# EAGLE design cellular shield-v12 (EAGLE 5.11)
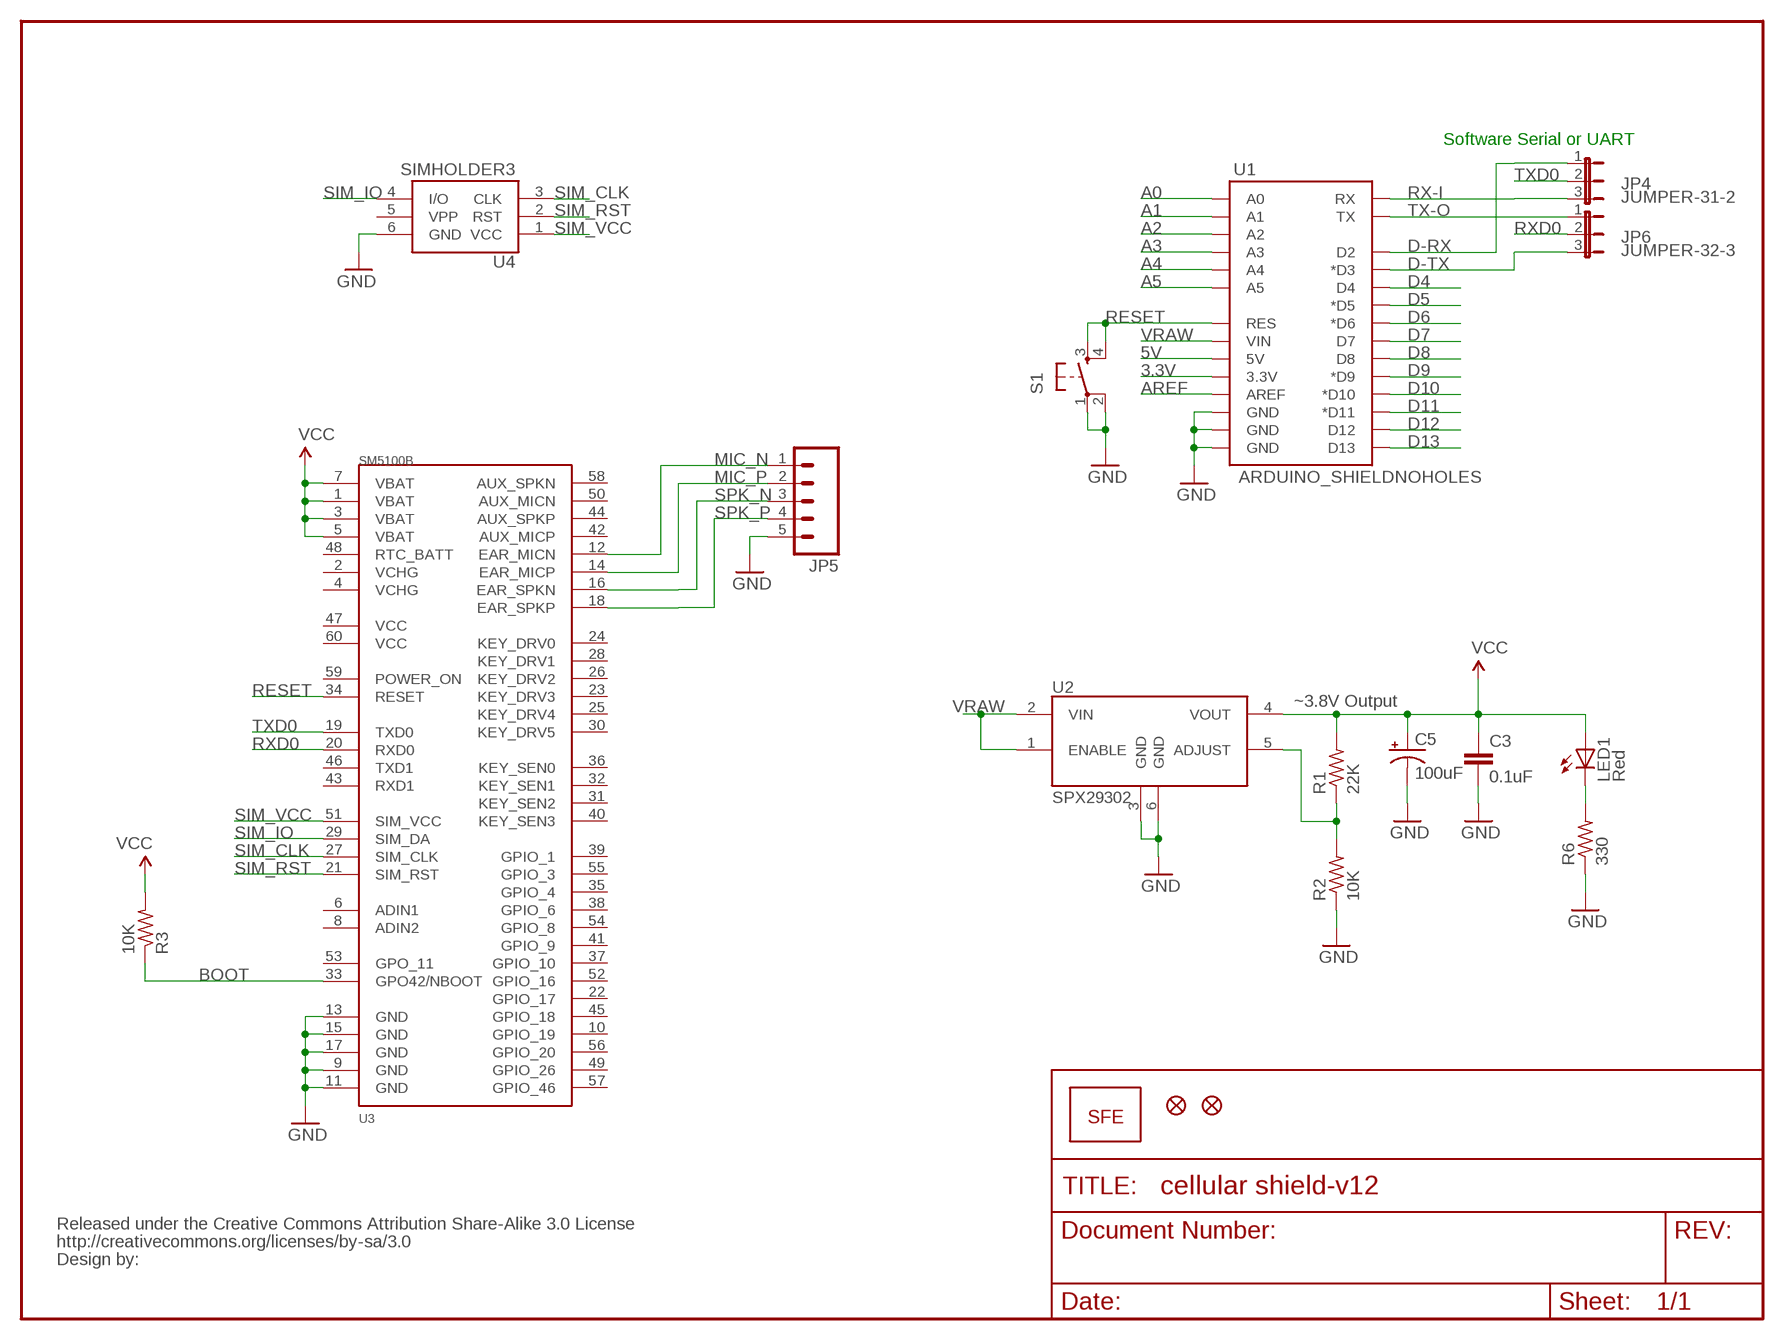
[diagram p0: schematic, sheet 1]

## Parts
C3  0.1uF  CAP0603-CAP  [0603-CAP]
C5  100uF  CAP_POL7343  [EIA7343]
JP1  LOGO-SFENEW  [SFE-NEW-WEBLOGO]
JP2  FIDUCIAL1X2  [FIDUCIAL-1X2]
JP3  FIDUCIAL1X2  [FIDUCIAL-1X2]
JP4  JUMPER-31-2  [SJ_3_PASTE1&2]
JP5  M05PTH  [1X05]
JP6  JUMPER-32-3  [SJ_3_PASTE2&3]
LED1  Red  LED0603  [LED-0603]
R1  22K  R-US_R0603  [R0603]
R2  10K  R-US_R0603  [R0603]
R3  10K  R-US_R0603  [R0603]
R6  330  R-US_R0603  [R0603]
S1  TAC_SWITCHSMD  [TACTILE_SWITCH_SMD]
U1  ARDUINO_SHIELDNOHOLES  [DUEMILANOVE_SHIELD_NOHOLES]
U2  SPX29302  [Q5-DD_SPX29300]
U3  SM5100B  [SM5100B]
U4  SIMHOLDER3  [SIMHOLDER3]
U$1  CREATIVE_COMMONS  [CREATIVE_COMMONS]

## Nets
3.3V: U1.3.3V
5V: U1.5V
A0: U1.A0
A1: U1.A1
A2: U1.A2
A3: U1.A3
A4: U1.A4
A5: U1.A5
ADJUST: R1.1 R2.2 U2.5(ADJUST)
AREF: U1.AREF
BOOT: R3.1 U3.33(GPO42/NBOOT)
D4: U1.D4
D5: U1.D5(*D5)
D6: U1.D6(*D6)
D7: U1.D7
D8: U1.D8
D9: U1.D9(*D9)
D10: U1.D10(*D10)
D11: U1.D11(*D11)
D12: U1.D12
D13: U1.D13
D-RX: JP4.1 U1.D2
D-TX: JP6.3 U1.D3(*D3)
GND: C3.2 C5.C(-) JP5.5 R2.1 R6.1 S1.1 S1.2 U1.GND@0(GND) U1.GND@1(GND) U1.GND@2(GND) U2.3(GND) U2.6(GND) U3.9(GND) U3.11(GND) U3.13(GND) U3.15(GND) U3.17(GND) U4.6(GND)
MIC_N: JP5.1 U3.12(EAR_MICN)
MIC_P: JP5.2 U3.14(EAR_MICP)
N$17: LED1.C R6.2
RESET: S1.3 S1.4 U1.RES U3.34(RESET)
RX-I: JP4.3 U1.RX
RXD0: JP6.2 U3.20(RXD0)
SIM_CLK: U3.27(SIM_CLK) U4.3(CLK)
SIM_IO: U3.29(SIM_DA) U4.4(I/O)
SIM_RST: U3.21(SIM_RST) U4.2(RST)
SIM_VCC: U3.51(SIM_VCC) U4.1(VCC)
SPK_N: JP5.3 U3.16(EAR_SPKN)
SPK_P: JP5.4 U3.18(EAR_SPKP)
TX-O: JP6.1 U1.TX
TXD0: JP4.2 U3.19(TXD0)
VCC: C3.1 C5.A(+) LED1.A R1.2 R3.2 U2.4(VOUT) U3.1(VBAT) U3.3(VBAT) U3.5(VBAT) U3.7(VBAT)
VRAW: U1.VIN U2.1(ENABLE) U2.2(VIN)
Unconnected: U3.2(VCHG) U3.4(VCHG) U3.6(ADIN1) U3.8(ADIN2) U3.10(GPIO_19) U3.22(GPIO_17) U3.23(KEY_DRV3) U3.24(KEY_DRV0) U3.25(KEY_DRV4) U3.26(KEY_DRV2) U3.28(KEY_DRV1) U3.30(KEY_DRV5) U3.31(KEY_SEN2) U3.32(KEY_SEN1) U3.35(GPIO_4) U3.36(KEY_SEN0) U3.37(GPIO_10) U3.38(GPIO_6) U3.39(GPIO_1) U3.40(KEY_SEN3) U3.41(GPIO_9) U3.42(AUX_MICP) U3.43(RXD1) U3.44(AUX_SPKP) U3.45(GPIO_18) U3.46(TXD1) U3.47(VCC) U3.48(RTC_BATT) U3.49(GPIO_26) U3.50(AUX_MICN) U3.52(GPIO_16) U3.53(GPO_11) U3.54(GPIO_8) U3.55(GPIO_3) U3.56(GPIO_20) U3.57(GPIO_46) U3.58(AUX_SPKN) U3.59(POWER_ON) U3.60(VCC) U4.5(VPP)

## Notes on the sheet
- Software Serial or UART
- ~3.8V Output

## Library data of the parts
C3 = SparkFun:CAP: Capacitor Standard 0603 ceramic capacitor, and 0.1" leaded capacitor.
C5 = SparkFun:CAP_POL: Capacitor Polarized These are standard SMD and PTH capacitors. Normally 10uF, 47uF, and 100uF in electrolytic and tantalum varieties. Always verify the external diameter of the through hole cap, it varies with capacity, voltage, and manufacturer. The EIA devices should be standard.
JP1 = SparkFun:LOGO-SFE: Spark Fun Electronics PCB Logo This is the standard Spark Fun Electronics PCB logo.
JP2 JP3 = SparkFun:FIDUCIAL: Fiducial Alignment Points Various fiducial points for machine vision alignment.
JP4 JP6 = SparkFun:JUMPER-3
JP5 = SparkFun:M05: Header 5 Standard 5-pin 0.1" header. Use with straight break away headers (SKU : PRT-00116), right angle break away headers (PRT-00553), swiss pins (PRT-00743), machine pins (PRT-00117), and female headers (PRT-00115). Molex polarized connector foot print use with SKU : PRT-08230 with associated crimp pins and housings.
LED1 = SparkFun:LED: LEDs Standard schematic elements and footprints for 5mm, 3mm, 1206, and 0603 sized LEDs. 5mm - Spark Fun Electronics SKU : COM-00529 (and others)
R1-R3 R6 = rcl:R-US_: RESISTOR, American symbol
S1 = SparkFun:TAC_SWITCH: Momentary Switch Button commonly used for reset or general input. Spark Fun Electronics SKU : COM-00097
U1 = SparkFun:ARDUINO_SHIELD
U2 = SparkFun:SPX29302
U3 = SparkFun:SM5100B
U4 = SparkFun:SIMHOLDER3
U$1 = SparkFun:CREATIVE_COMMONS

## Net classes
0 default: width 0.203 mm

## Board
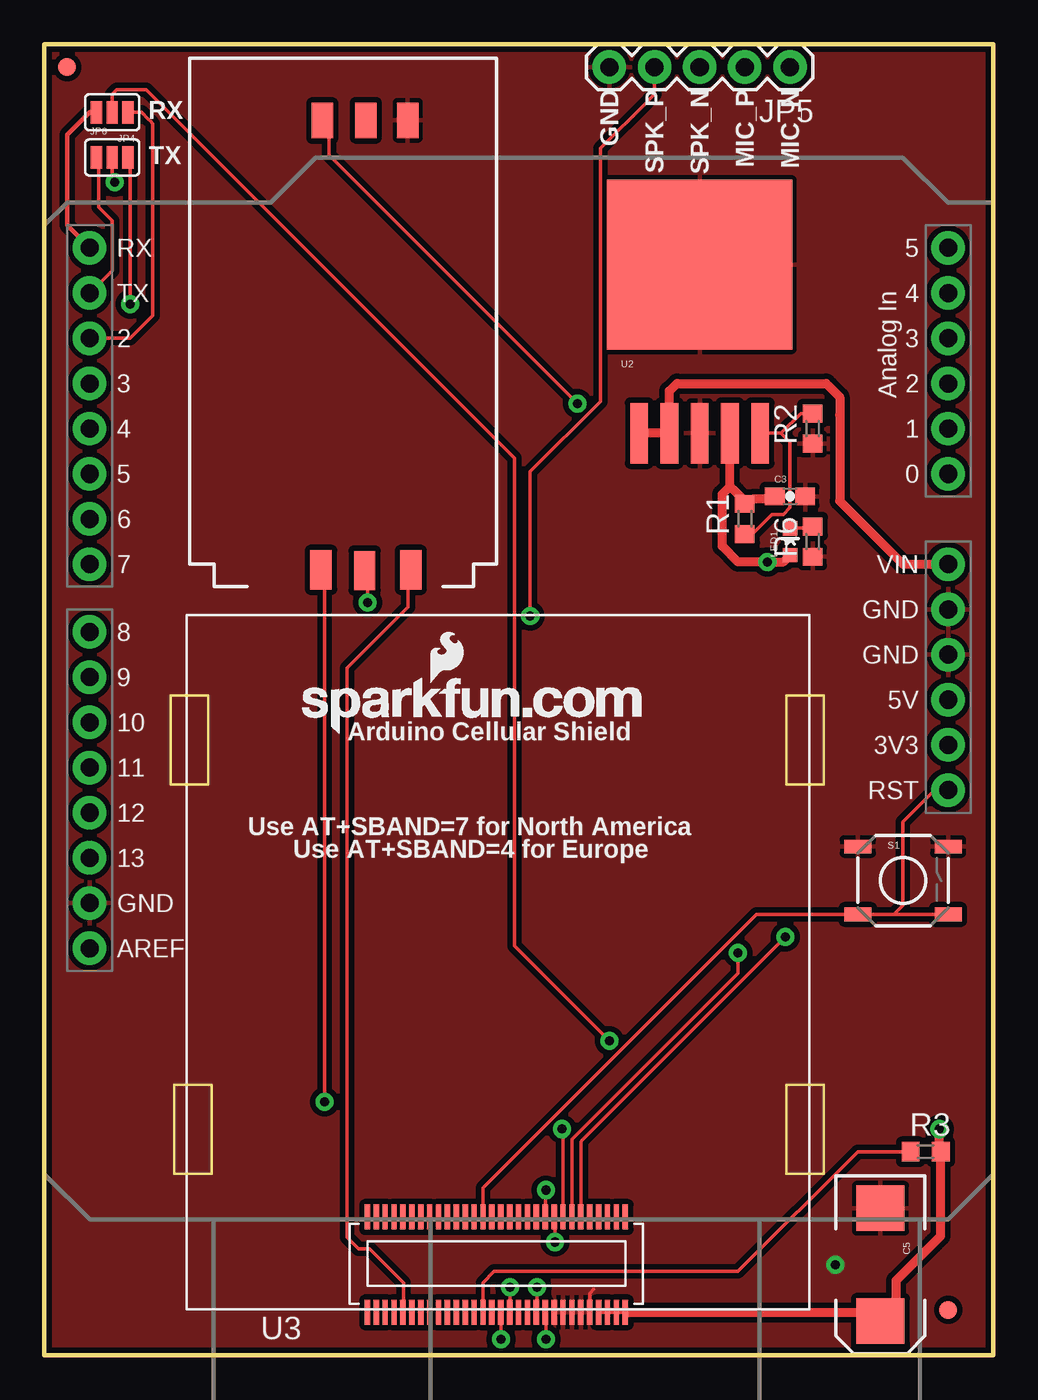
[diagram p1: board, top side]
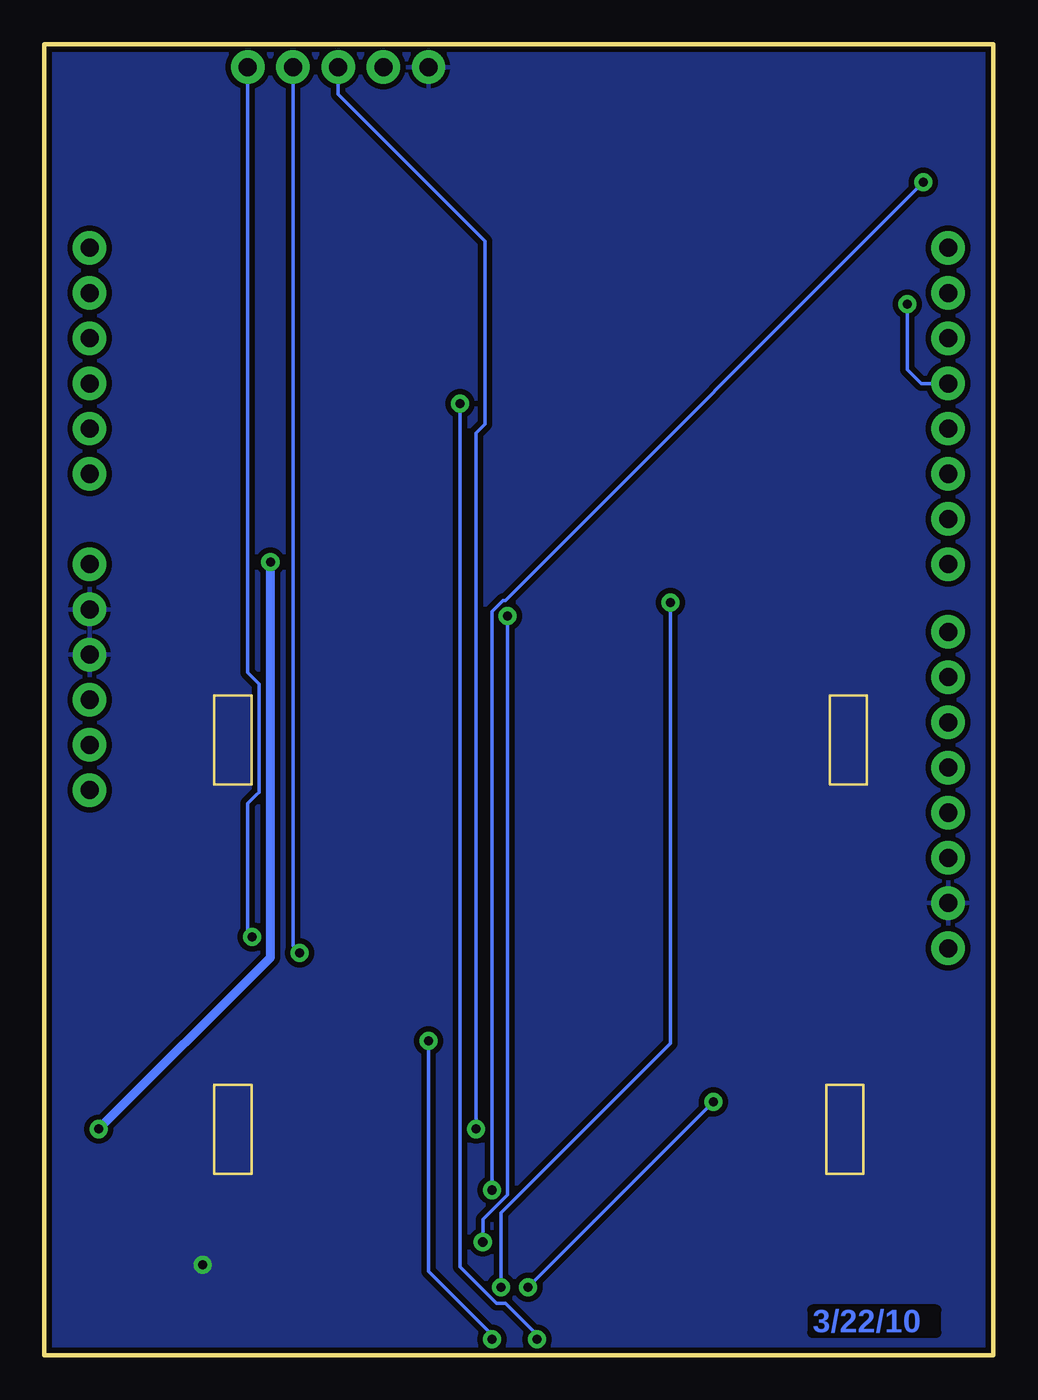
[diagram p2: board, bottom side, seen from below]

Size 53.34 x 73.66 mm. Coordinates in mm from the lower left corner, seen from the top.
Outline: 0,0 53.34,0 53.34,73.66 0,73.66 0,0
Copper layers (1*16): Top 0.035mm / dielectric 1.5mm / Bottom 0.035mm
Design rules "SparkFun *": minimum track width 8mil, minimum drill 20mil, track to track 7mil, track to pad 7mil, pad to pad 7mil, via to via 7mil, smd to smd 7mil, copper to edge 9mil, drill to drill 8mil, minimum pad ring 12mil, minimum via ring 10mil, stop-mask expansion 4mil, vias tented up to drill 20mil, thermal gap 10mil

### Footprints (pad centres in the part's own frame; a part is rotated, then mirrored left to right if it is on the bottom)
0603-CAP = smd 1.1 x 1: 1 -0.85,0; 2 0.85,0
EIA7343 = smd 2.55 x 2.7: A 3.17,0; C -3.17,0
FIDUCIAL-1X2 = smd 1 x 1: 1 0,0
SJ_3_PASTE1&2 = smd 0.635 x 1.27: 1 -0.889,0; 2 0,0; 3 0.889,0
1X05 = drill 1.016 pad 1.88 round: 1 0,0; 2 2.54,0; 3 5.08,0; 4 7.62,0; 5 10.16,0
SJ_3_PASTE2&3 = smd 0.635 x 1.27: 1 -0.889,0; 2 0,0; 3 0.889,0
LED-0603 = smd 0.8 x 0.8: A 0,-0.75; C 0,0.75
R0603 = smd 1 x 1.1: 1 -0.85,0; 2 0.85,0
TACTILE_SWITCH_SMD = smd 1.524 x 0.762: 1 -2.54,1.905; 2 2.54,1.905; 3 -2.54,-1.905; 4 2.54,-1.905
DUEMILANOVE_SHIELD_NOHOLES = drill 1.016 pad 1.88 round: 3.3V 50.8,26.67; 5V 50.8,29.21; A0 50.8,41.91; A1 50.8,44.45; A2 50.8,46.99; A3 50.8,49.53; A4 50.8,52.07; A5 50.8,54.61; AREF 2.54,15.24; D2 2.54,49.53; D3 2.54,46.99; D4 2.54,44.45; D5 2.54,41.91; D6 2.54,39.37; D7 2.54,36.83; D8 2.54,33.02; D9 2.54,30.48; D10 2.54,27.94; D11 2.54,25.4; D12 2.54,22.86; D13 2.54,20.32; GND@0 50.8,31.75; GND@1 50.8,34.29; GND@2 2.54,17.78; RES 50.8,24.13; RX 2.54,54.61; TX 2.54,52.07; VIN 50.8,36.83
Q5-DD_SPX29300 = smd 1 x 3.4: 1 -3.4,-7.875; 2 -1.7,-7.875; 3 0,-7.875; 4 1.7,-7.875; 5 3.4,-7.875 | smd 10.414 x 9.525: 6 0,1.595
SM5100B = smd 0.3 x 1.4: 1 7.25,-2.68; 2 7.25,2.68; 3 6.75,-2.68; 4 6.75,2.68; 5 6.25,-2.68; 6 6.25,2.68; 7 5.75,-2.68; 8 5.75,2.68; 9 5.25,-2.68; 10 5.25,2.68; 11 4.75,-2.68; 12 4.75,2.68; 13 4.25,-2.68; 14 4.25,2.68; 15 3.75,-2.68; 16 3.75,2.68; 17 3.25,-2.68; 18 3.25,2.68; 19 2.75,-2.68; 20 2.75,2.68; 21 2.25,-2.68; 22 2.25,2.68; 23 1.75,-2.68; 24 1.75,2.68; 25 1.25,-2.68; 26 1.25,2.68; 27 0.75,-2.68; 28 0.75,2.68; 29 0.25,-2.68; 30 0.25,2.68; 31 -0.25,-2.68; 32 -0.25,2.68; 33 -0.75,-2.68; 34 -0.75,2.68; 35 -1.25,-2.68; 36 -1.25,2.68; 37 -1.75,-2.68; 38 -1.75,2.68; 39 -2.25,-2.68; 40 -2.25,2.68; 41 -2.75,-2.68; 42 -2.75,2.68; 43 -3.25,-2.68; 44 -3.25,2.68; 45 -3.75,-2.68; 46 -3.75,2.68; 47 -4.25,-2.68; 48 -4.25,2.68; 49 -4.75,-2.68; 50 -4.75,2.68; 51 -5.25,-2.68; 52 -5.25,2.68; 53 -5.75,-2.68; 54 -5.75,2.68; 55 -6.25,-2.68; 56 -6.25,2.68; 57 -6.75,-2.68; 58 -6.75,2.68; 59 -7.25,-2.68; 60 -7.25,2.68
SIMHOLDER3 = smd 2.2 x 1.2: 1 0.95,4.81; 2 0.91,7.41; 3 0.95,9.86 | smd 2 x 1.2: 4 26.2,9.78; 5 26.22,7.34; 6 26.22,4.98

### Placement (x,y rotation side)
C3  41.91,48.26 0 top
C5  46.99,5.08 270 top
JP1  14.48,34.92 0 top
JP2  1.27,72.39 0 top
JP3  50.8,2.54 0 top
JP4  3.81,69.85 180 top
JP5  41.91,72.39 180 top
JP6  3.81,67.31 0 top
LED1  41.91,45.72 0 top
R1  39.37,46.99 90 top
R2  43.18,52.07 90 top
R3  49.53,11.43 0 top
R6  43.18,45.72 90 top
S1  48.26,26.67 0 top
U1  0,7.62 0 top
U2  36.83,59.69 0 top
U3  25.4,5.08 0 top
U4  25.4,43.18 90 top
U$1  20.32,-16.51 0 top  (outside the outline)

### Tracks (layer width: path | path; a pad name or v marks a point on that pad's centre or on a via)
ADJUST
  Top 0.203: R1.1 39.79,46.14 40.64,46.99 40.89,47.24 41.27,47.24 41.53,47.24 41.91,47.62 41.91,51.31 41.4,51.82 | U2.5 41.4,51.81 41.4,51.82 | R2.2 42.51,52.92 41.4,51.82
BOOT
  Top 0.203: U3.33 24.64,3.05 24.64,4.06 25.27,4.7 31.88,4.7 38.99,4.7 45.72,11.43 48.26,11.43 R3.1
D-RX
  Top 0.203: JP4.1 5.46,69.85 5.84,69.47 5.97,69.34 6.1,69.22 6.1,59.18 6.1,59.05 6.1,58.42 4.83,57.15 U1.D2
D-TX  (via drill 0.51)
  Top 0.203: v4.83,59.05 4.83,66.8 JP6.3
  Bottom 0.203: v4.83,59.05 4.83,55.37 4.45,54.99 4.06,54.61 U1.D3
GND  (via drill 0.51)
  Top 0.203: U3.9 30.65,3.47 30.86,3.68
  other vias: 44.45,5.08
  pour Top (isolate 0.305): 0,0 0,73.66 53.34,73.66 53.34,0
  pour Bottom (isolate 0.305): 0,0 0,73.66 53.34,73.66 53.34,0
MIC_N  (via drill 0.51)
  Top 0.203: 30.15,11.99 30.23,12.06 | 30.23,12.06 v41.66,23.5 | U3.12 30.15,11.99 | 30.15,11.99 30.23,12.06
  Bottom 0.203: JP5.1 41.91,38.48 41.91,38.35 41.4,37.85 41.27,37.72 41.27,32.26 41.27,31.62 41.4,31.5 41.91,30.99 41.91,30.48 41.91,23.75 v41.66,23.5
MIC_P  (via drill 0.51)
  Top 0.203: v38.99,22.61 38.99,21.46 38.86,21.34 30.61,13.08 29.65,12.12 U3.14
  Bottom 0.203: JP5.2 39.37,22.99 v38.99,22.61
N$17
  Top 0.203: LED1.C 42.29,46.48 42.67,46.48 R6.2
RESET
  Top 0.203: 47.75,24.77 46.35,24.77 S1.3 45.09,24.77 40.01,24.77 24.65,9.41 U3.34 | 47.75,24.77 48.9,24.77 50.16,24.77 S1.4 | U1.RES 50.04,31.75 48.26,29.97 48.26,25.27 47.75,24.77
RX-I
  Top 0.254: JP4.3 2.54,69.85 1.27,68.58 1.27,63.5 U1.RX
RXD0  (via drill 0.51)
  Top 0.203: JP6.2 3.81,66.04 v3.94,65.91 | U3.20 28.15,9.23 v28.19,9.27
  Bottom 0.203: v3.94,65.91 27.43,42.42 27.56,42.42 28.19,41.78 v28.19,9.27
SIM_CLK  (via drill 0.51)
  Top 0.203: v26.16,3.81 26.16,3.05 U3.27 | v15.75,14.22 15.75,43.05 U4.3
  Bottom 0.203: v26.16,3.81 v15.75,14.22
SIM_IO  (via drill 0.51)
  Top 0.203: v25.65,0.89 25.65,1.78 U3.29 | v29.97,53.47 16,67.44 16,68.45 U4.4
  Bottom 0.203: v25.65,0.89 25.65,1.14 27.43,2.92 27.94,2.92 29.97,4.95 v29.97,53.47
SIM_RST  (via drill 0.51)
  Top 0.203: v27.69,3.81 27.69,3.05 U3.21 | v18.16,42.29 18.16,43.05 U4.2
  Bottom 0.203: v27.69,3.81 27.69,8 18.16,17.53 v18.16,42.29
SIM_VCC
  Top 0.203: U3.51 20.19,3.05 20.19,4.06 18.29,5.97 17.65,5.97 17.02,6.6 17.02,38.61 20.45,42.04 20.45,43.05 U4.1
SPK_N  (via drill 0.51)
  Top 0.203: U3.16 29.15,12.63 v29.08,12.7
  Bottom 0.203: v29.08,12.7 29.08,51.82 28.57,52.32 28.57,62.61 36.45,70.48 36.58,70.61 36.83,70.87 JP5.3
SPK_P  (via drill 0.51)
  Top 0.203: v28.7,6.35 28.7,7.11 U3.18 | v27.3,41.53 27.3,49.66 31.24,53.59 31.24,67.82 33.91,70.48 34.04,70.61 34.29,70.87 JP5.4
  Bottom 0.203: v28.7,6.35 28.7,7.62 27.3,9.02 v27.3,41.53
TX-O
  Top 0.203: JP6.1 3.05,66.8 3.05,64.52 3.81,63.75 3.81,60.96 U1.TX
TXD0  (via drill 0.51)
  Top 0.203: v31.75,17.65 26.42,22.99 26.42,50.42 5.97,70.87 5.84,70.99 5.71,71.12 4.06,71.12 3.81,70.87 JP4.2 | v28.19,0.89 28.19,1.78 U3.19
  Bottom 0.203: v31.75,17.65 31.75,4.7 28.19,1.14 v28.19,0.89
VCC  (via drill 0.51)
  Top 0.203: U3.7 31.24,2.41 31.62,2.41 U3.5 31.75,2.41 32,2.41 U3.3 32.26,2.41 32.51,2.41 U3.1 32.77,2.41 | R3.2 50.29,11.94 | 38.73,48.64 38.53,48.85 38.53,48.82 38.48,48.77 | 39.37,48.01 R1.2 | 49.91,6.22 50.04,6.35
  Top 0.508: LED1.A 41.53,44.58 v40.64,44.58 38.99,44.58 38.1,45.47 38.1,48.39 38.48,48.77 | C3.1 40.51,48.13 39.88,48.13 R1.2 | 49.91,6.22 47.88,4.19 47.88,3.17 C5.A 45.72,2.41 32.77,2.41 | 50.29,11.94 v50.29,12.7 | 38.53,48.85 U2.4 | 38.73,48.64 38.86,48.51 39.37,48.01 | R3.2 50.38,6.69 50.04,6.35
  Bottom 0.508: v40.64,44.58 40.64,22.35 v50.29,12.7
VRAW
  Top 0.203: 43.94,54.61 44.07,54.48 | U2.2 34.8,51.81 34.8,51.82 34.8,51.81
  Top 0.508: 44.07,54.48 44.7,53.85 44.7,52.83 44.7,48.01 48.26,44.45 U1.VIN | U2.2 35.13,54.18 35.56,54.61 43.94,54.61 | 34.8,51.81 U2.1

### Text on the board
Bottom: 3/22/10
tPlace: GND | SPK_P | SPK_N | MIC_P | MIC_N | RX | TX | Arduino Cellular Shield | Use AT+SBAND=7 for North America | Use AT+SBAND=4 for Europe